# Altium schematic sheet 模拟均衡器2.SchDoc
size A4
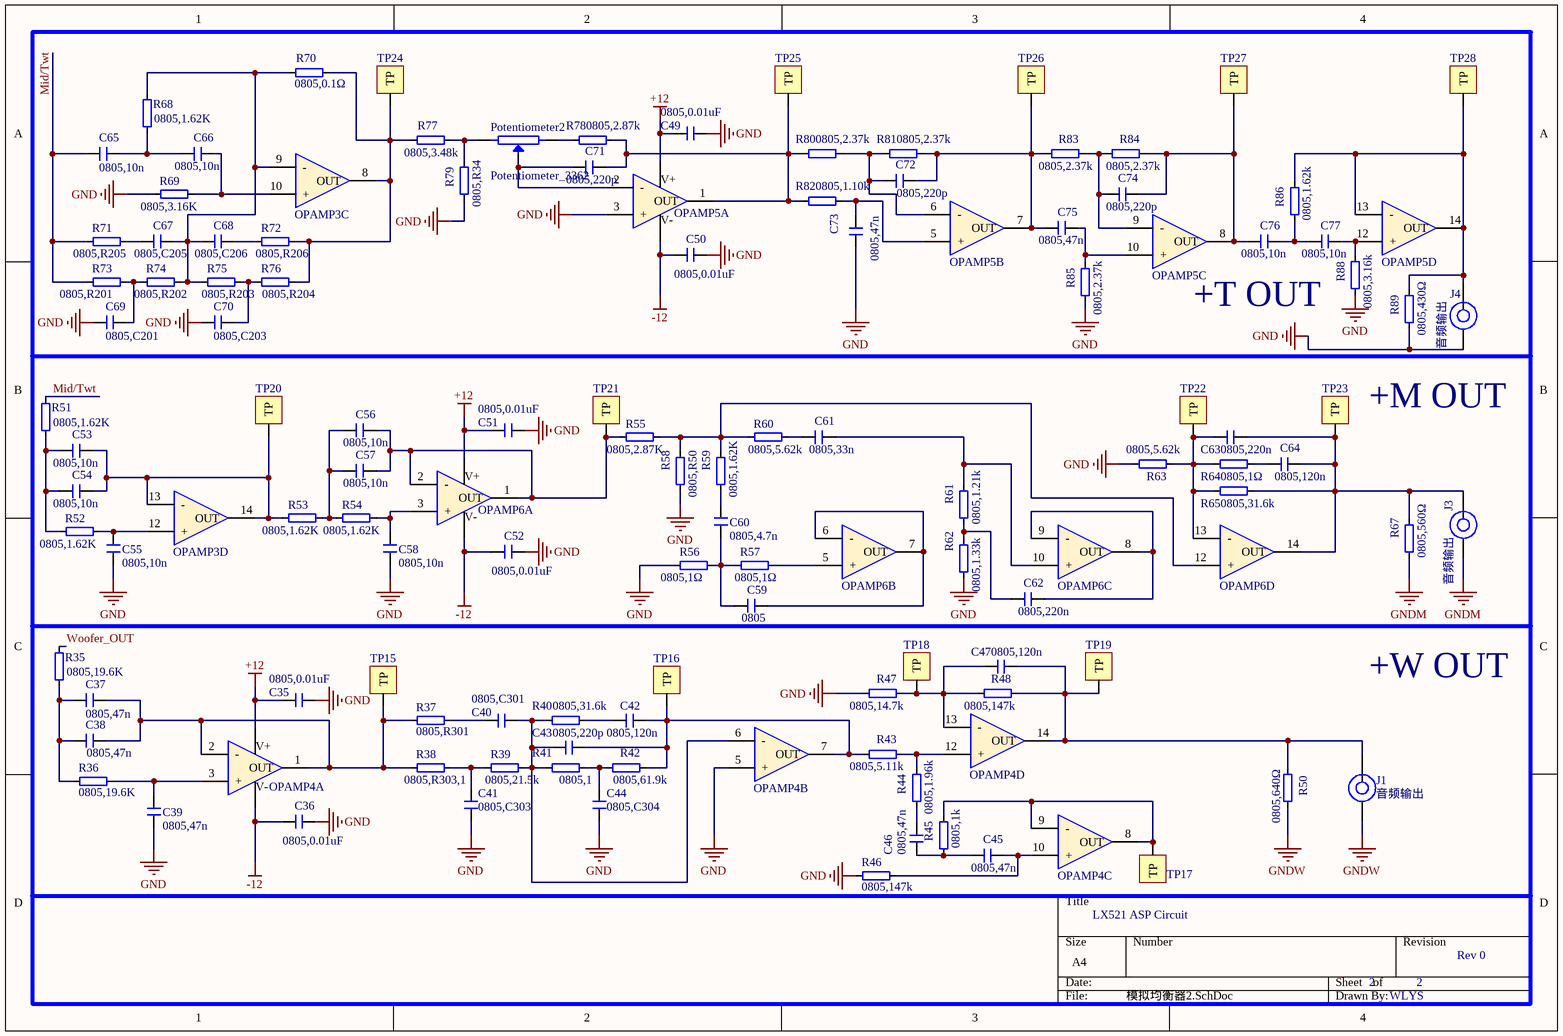
[diagram p0: 模拟均衡器2.SchDoc]

## Parts
C35  0805,0.01uF  [0805_C]
C36  0805,0.01uF  [0805_C]
C37  0805,47n  [0805_C]
C38  0805,47n  [0805_C]
C39  0805,47n  [0805_C]
C40  0805,C301  [0805_C]
C41  0805,C303  [0805_C]
C42  0805,120n  [0805_C]
C43  0805,220p  [0805_C]
C44  0805,C304  [0805_C]
C45  0805,47n  [0805_C]
C46  0805,47n  [0805_C]
C47  0805,120n  [0805_C]
C49  0805,0.01uF  [0805_C]
C50  0805,0.01uF  [0805_C]
C51  0805,0.01uF  [0805_C]
C52  0805,0.01uF  [0805_C]
C53  0805,10n  [0805_C]
C54  0805,10n  [0805_C]
C55  0805,10n  [0805_C]
C56  0805,10n  [0805_C]
C57  0805,10n  [0805_C]
C58  0805,10n  [0805_C]
C59  0805  [0805_C]
C60  0805,4.7n  [0805_C]
C61  0805,33n  [0805_C]
C62  0805,220n  [0805_C]
C63  0805,220n  [0805_C]
C64  0805,120n  [0805_C]
C65  0805,10n  [0805_C]
C66  0805,10n  [0805_C]
C67  0805,C205  [0805_C]
C68  0805,C206  [0805_C]
C69  0805,C201  [0805_C]
C70  0805,C203  [0805_C]
C71  0805,220p  [0805_C]
C72  0805,220p  [0805_C]
C73  0805,47n  [0805_C]
C74  0805,220p  [0805_C]
C75  0805,47n  [0805_C]
C76  0805,10n  [0805_C]
C77  0805,10n  [0805_C]
J1  音频输出
J3  音频输出
J4  音频输出
OPAMP3  4277UA  [SOIC-14_150mil]  (value not drawn)  (parts C,D of 4)
OPAMP4  4277UA  [SOIC-14_150mil]  (value not drawn)  (parts A,B,C,D of 4)
OPAMP5  4277UA  [SOIC-14_150mil]  (value not drawn)  (parts A,B,C,D of 4)
OPAMP6  4277UA  [SOIC-14_150mil]  (value not drawn)  (parts A,B,C,D of 4)
Potentiometer2  Potentiometer_3362  [3362P]
R35  0805,19.6K  [0805_R]
R36  0805,19.6K  [0805_R]
R37  0805,R301  [0805_R]
R38  0805,R303,1  [0805_R]
R39  0805,21.5k  [0805_R]
R40  0805,31.6k  [0805_R]
R41  0805,1  [0805_R]
R42  0805,61.9k  [0805_R]
R43  0805,5.11k  [0805_R]
R44  0805,1.96k  [0805_R]
R45  0805,1k  [0805_R]
R46  0805,147k  [0805_R]
R47  0805,14.7k  [0805_R]
R48  0805,147k  [0805_R]
R50  0805,640Ω  [0805_R]
R51  0805,1.62K  [0805_R]
R52  0805,1.62K  [0805_R]
R53  0805,1.62K  [0805_R]
R54  0805,1.62K  [0805_R]
R55  0805,2.87K  [0805_R]
R56  0805,1Ω  [0805_R]
R57  0805,1Ω  [0805_R]
R58  0805,R50  [0805_R]
R59  0805,1.62K  [0805_R]
R60  0805,5.62k  [0805_R]
R61  0805,1.21k  [0805_R]
R62  0805,1.33k  [0805_R]
R63  0805,5.62k  [0805_R]
R64  0805,1Ω  [0805_R]
R65  0805,31.6k  [0805_R]
R67  0805,560Ω  [0805_R]
R68  0805,1.62K  [0805_R]
R69  0805,3.16K  [0805_R]
R70  0805,0.1Ω  [0805_R]
R71  0805,R205  [0805_R]
R72  0805,R206  [0805_R]
R73  0805,R201  [0805_R]
R74  0805,R202  [0805_R]
R75  0805,R203  [0805_R]
R76  0805,R204  [0805_R]
R77  0805,3.48k  [0805_R]
R78  0805,2.87k  [0805_R]
R79  0805,R34  [0805_R]
R80  0805,2.37k  [0805_R]
R81  0805,2.37k  [0805_R]
R82  0805,1.10k  [0805_R]
R83  0805,2.37k  [0805_R]
R84  0805,2.37k  [0805_R]
R85  0805,2.37k  [0805_R]
R86  0805,1.62k  [0805_R]
R88  0805,3.16k  [0805_R]
R89  0805,430Ω  [0805_R]
TP15  测试点  [TestPoint]  (value not drawn)
TP16  测试点  [TestPoint]  (value not drawn)
TP17  测试点  [TestPoint]  (value not drawn)
TP18  测试点  [TestPoint]  (value not drawn)
TP19  测试点  [TestPoint]  (value not drawn)
TP20  测试点  [TestPoint]  (value not drawn)
TP21  测试点  [TestPoint]  (value not drawn)
TP22  测试点  [TestPoint]  (value not drawn)
TP23  测试点  [TestPoint]  (value not drawn)
TP24  测试点  [TestPoint]  (value not drawn)
TP25  测试点  [TestPoint]  (value not drawn)
TP26  测试点  [TestPoint]  (value not drawn)
TP27  测试点  [TestPoint]  (value not drawn)
TP28  测试点  [TestPoint]  (value not drawn)

## Nets
+12: C35.1 C49.1 C51.1 OPAMP4.4(V+) OPAMP5.4(V+) OPAMP6.4(V+)
-12: C36.1 C50.1 C52.1 OPAMP4.11(V-) OPAMP5.11(V-) OPAMP6.11(V-)
GND: C35.2 C36.2 C39.2 C41.1 C44.1 C49.2 C50.2 C51.2 C52.2 C55.2 C58.2 C69.2 C70.1 C73.2 J4.2(GND) OPAMP4.5(+) OPAMP5.3(+) R46.2 R47.1 R56.1 R58.1 R62.1 R63.1 R69.1 R79.1 R85.1 R88.2 R89.2
GNDM: J3.2(GND) R67.1
GNDW: J1.2(GND) R50.2
Mid/Twt: C65.1 R51.1 R71.1 R73.1
Woofer_OUT: R35.1
NetC37_1: C37.1 C38.1 OPAMP4.1(OUT) OPAMP4.2(-) R37.1 R38.1 TP15.1(TP)
NetC37_2: C37.2 C38.2 R35.2 R36.1
NetC39_1: C39.1 OPAMP4.3(+) R36.2
NetC40_1: C40.1 R37.2
NetC40_2: C40.2 C43.1 OPAMP4.6(-) R39.2 R40.1 R41.1
NetC41_2: C41.2 R38.2 R39.1
NetC42_1: C42.1 R40.2
NetC42_2: C42.2 C43.2 OPAMP4.7(OUT) R42.2 R43.1 TP16.1(TP)
NetC44_2: C44.2 R41.2 R42.1
NetC45_1: C45.1 C46.2 R45.1
NetC45_2: C45.2 OPAMP4.10(+) R46.1
NetC46_1: C46.1 R44.1
NetC47_1: C47.1 OPAMP4.13(-) R47.2 R48.1 TP18.1(TP)
NetC47_2: C47.2 J1.1(MIC) OPAMP4.14(OUT) R48.2 R50.1 TP19.1(TP)
NetC53_1: C53.1 C54.1 OPAMP3.13(-) OPAMP3.14(OUT) R53.1 TP20.1(TP)
NetC53_2: C53.2 C54.2 R51.2 R52.1
NetC55_1: C55.1 OPAMP3.12(+) R52.2
NetC56_1: C56.1 C57.1 R53.2 R54.1
NetC56_2: C56.2 C57.2 OPAMP6.1(OUT) OPAMP6.2(-) R55.1 TP21.1(TP)
NetC58_1: C58.1 OPAMP6.3(+) R54.2
NetC59_1: C59.1 C60.1 R56.2 R57.1
NetC59_2: C59.2 OPAMP6.6(-) OPAMP6.7(OUT)
NetC60_2: C60.2 R59.1
NetC61_1: C61.1 R60.2
NetC61_2: C61.2 OPAMP6.10(+) R61.2
NetC62_1: C62.1 R61.1 R62.2
NetC62_2: C62.2 OPAMP6.8(OUT) OPAMP6.9(-)
NetC63_1: C63.1 OPAMP6.13(-) R63.2 R64.1 R65.1 TP22.1(TP)
NetC63_2: C63.2 C64.2 J3.1(MIC) OPAMP6.14(OUT) R65.2 R67.2 TP23.1(TP)
NetC64_1: C64.1 R64.2
NetC65_2: C65.2 C66.2 R68.2
NetC66_1: C66.1 OPAMP3.10(+) R69.2
NetC67_1: C67.1 C68.2 OPAMP3.9(-) R68.1 R70.1 R74.2 R75.1
NetC67_2: C67.2 R71.2
NetC68_1: C68.1 R72.1
NetC69_1: C69.1 R73.2 R74.1
NetC70_2: C70.2 R75.2 R76.1
NetC71_1: C71.1 OPAMP5.1(OUT) R78.2 R80.1 R82.1 TP25.1(TP)
NetC71_2: C71.2 OPAMP5.2(-) Potentiometer2.2(W)
NetC72_1: C72.1 OPAMP5.6(-) R80.2 R81.1
NetC72_2: C72.2 C75.1 OPAMP5.7(OUT) R81.2 R83.1 TP26.1(TP)
NetC73_1: C73.1 OPAMP5.5(+) R82.2
NetC74_1: C74.1 OPAMP5.9(-) R83.2 R84.1
NetC74_2: C74.2 C76.1 OPAMP5.8(OUT) R84.2 TP27.1(TP)
NetC75_2: C75.2 OPAMP5.10(+) R85.2
NetC76_2: C76.2 C77.1 R86.1
NetC77_2: C77.2 OPAMP5.12(+) R88.1
NetJ4_1: J4.1(MIC) OPAMP5.13(-) OPAMP5.14(OUT) R86.2 R89.1 TP28.1(TP)
NetOPAMP3_8: OPAMP3.8(OUT) R70.2 R72.2 R76.2 R77.1 TP24.1(TP)
NetOPAMP4_8: OPAMP4.8(OUT) OPAMP4.9(-) R45.2 TP17.1(TP)
NetOPAMP4_12: OPAMP4.12(+) R43.2 R44.2
NetOPAMP6_5: OPAMP6.5(+) R57.2
NetOPAMP6_12: OPAMP6.12(+) R55.2 R58.2 R59.2 R60.1
NetPotentiometer2_1: Potentiometer2.1 R78.1
NetPotentiometer2_3: Potentiometer2.3 R77.2 R79.2

## Notes on the sheet
- +T OUT
- +M OUT
- +W OUT
- LX521 ASP Circuit
- 2
- Rev 0
- WLYS

## Library data of the parts
C35 C36 C40-C44 C47 C49-C52 = C0805: 0.01uF
C37-C39 C45 C46 C53-C77 = C0805
OPAMP3-OPAMP6 = OPA4277UA
R35-R48 R50-R65 R67-R86 R88 R89 = R0805